# EAGLE design TinyCube01 (EAGLE 7.5.0)
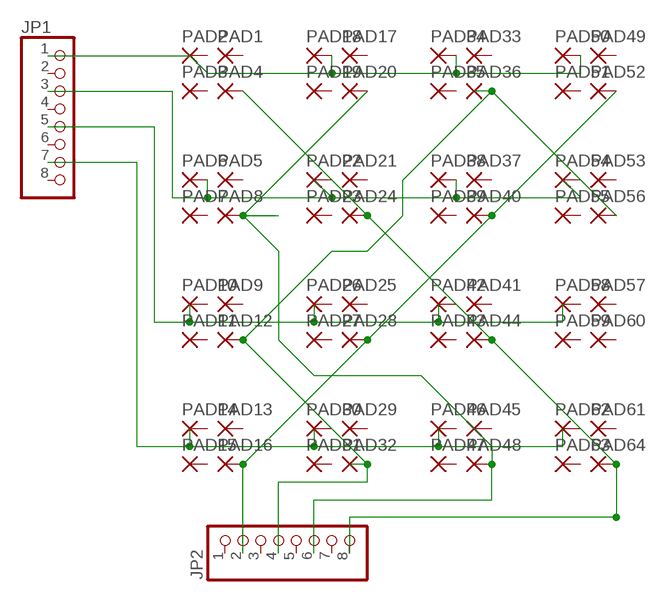
[diagram p0: schematic, sheet 1]

## Parts
JP1  PINHD-1X8BIG  [1X08-BIG]
JP2  PINHD-1X8BIG  [1X08-BIG]
PAD1  SMALLPADTHROUGH-HOLE-SMALL  [SMALLPAD]
PAD2  SMALLPADTHROUGH-HOLE-SMALL  [SMALLPAD]
PAD3  SMALLPADTHROUGH-HOLE-SMALL  [SMALLPAD]
PAD4  SMALLPADTHROUGH-HOLE-SMALL  [SMALLPAD]
PAD5  SMALLPADTHROUGH-HOLE-SMALL  [SMALLPAD]
PAD6  SMALLPADTHROUGH-HOLE-SMALL  [SMALLPAD]
PAD7  SMALLPADTHROUGH-HOLE-SMALL  [SMALLPAD]
PAD8  SMALLPADTHROUGH-HOLE-SMALL  [SMALLPAD]
PAD9  SMALLPADTHROUGH-HOLE-SMALL  [SMALLPAD]
PAD10  SMALLPADTHROUGH-HOLE-SMALL  [SMALLPAD]
PAD11  SMALLPADTHROUGH-HOLE-SMALL  [SMALLPAD]
PAD12  SMALLPADTHROUGH-HOLE-SMALL  [SMALLPAD]
PAD13  SMALLPADTHROUGH-HOLE-SMALL  [SMALLPAD]
PAD14  SMALLPADTHROUGH-HOLE-SMALL  [SMALLPAD]
PAD15  SMALLPADTHROUGH-HOLE-SMALL  [SMALLPAD]
PAD16  SMALLPADTHROUGH-HOLE-SMALL  [SMALLPAD]
PAD17  SMALLPADTHROUGH-HOLE-SMALL  [SMALLPAD]
PAD18  SMALLPADTHROUGH-HOLE-SMALL  [SMALLPAD]
PAD19  SMALLPADTHROUGH-HOLE-SMALL  [SMALLPAD]
PAD20  SMALLPADTHROUGH-HOLE-SMALL  [SMALLPAD]
PAD21  SMALLPADTHROUGH-HOLE-SMALL  [SMALLPAD]
PAD22  SMALLPADTHROUGH-HOLE-SMALL  [SMALLPAD]
PAD23  SMALLPADTHROUGH-HOLE-SMALL  [SMALLPAD]
PAD24  SMALLPADTHROUGH-HOLE-SMALL  [SMALLPAD]
PAD25  SMALLPADTHROUGH-HOLE-SMALL  [SMALLPAD]
PAD26  SMALLPADTHROUGH-HOLE-SMALL  [SMALLPAD]
PAD27  SMALLPADTHROUGH-HOLE-SMALL  [SMALLPAD]
PAD28  SMALLPADTHROUGH-HOLE-SMALL  [SMALLPAD]
PAD29  SMALLPADTHROUGH-HOLE-SMALL  [SMALLPAD]
PAD30  SMALLPADTHROUGH-HOLE-SMALL  [SMALLPAD]
PAD31  SMALLPADTHROUGH-HOLE-SMALL  [SMALLPAD]
PAD32  SMALLPADTHROUGH-HOLE-SMALL  [SMALLPAD]
PAD33  SMALLPADTHROUGH-HOLE-SMALL  [SMALLPAD]
PAD34  SMALLPADTHROUGH-HOLE-SMALL  [SMALLPAD]
PAD35  SMALLPADTHROUGH-HOLE-SMALL  [SMALLPAD]
PAD36  SMALLPADTHROUGH-HOLE-SMALL  [SMALLPAD]
PAD37  SMALLPADTHROUGH-HOLE-SMALL  [SMALLPAD]
PAD38  SMALLPADTHROUGH-HOLE-SMALL  [SMALLPAD]
PAD39  SMALLPADTHROUGH-HOLE-SMALL  [SMALLPAD]
PAD40  SMALLPADTHROUGH-HOLE-SMALL  [SMALLPAD]
PAD41  SMALLPADTHROUGH-HOLE-SMALL  [SMALLPAD]
PAD42  SMALLPADTHROUGH-HOLE-SMALL  [SMALLPAD]
PAD43  SMALLPADTHROUGH-HOLE-SMALL  [SMALLPAD]
PAD44  SMALLPADTHROUGH-HOLE-SMALL  [SMALLPAD]
PAD45  SMALLPADTHROUGH-HOLE-SMALL  [SMALLPAD]
PAD46  SMALLPADTHROUGH-HOLE-SMALL  [SMALLPAD]
PAD47  SMALLPADTHROUGH-HOLE-SMALL  [SMALLPAD]
PAD48  SMALLPADTHROUGH-HOLE-SMALL  [SMALLPAD]
PAD49  SMALLPADTHROUGH-HOLE-SMALL  [SMALLPAD]
PAD50  SMALLPADTHROUGH-HOLE-SMALL  [SMALLPAD]
PAD51  SMALLPADTHROUGH-HOLE-SMALL  [SMALLPAD]
PAD52  SMALLPADTHROUGH-HOLE-SMALL  [SMALLPAD]
PAD53  SMALLPADTHROUGH-HOLE-SMALL  [SMALLPAD]
PAD54  SMALLPADTHROUGH-HOLE-SMALL  [SMALLPAD]
PAD55  SMALLPADTHROUGH-HOLE-SMALL  [SMALLPAD]
PAD56  SMALLPADTHROUGH-HOLE-SMALL  [SMALLPAD]
PAD57  SMALLPADTHROUGH-HOLE-SMALL  [SMALLPAD]
PAD58  SMALLPADTHROUGH-HOLE-SMALL  [SMALLPAD]
PAD59  SMALLPADTHROUGH-HOLE-SMALL  [SMALLPAD]
PAD60  SMALLPADTHROUGH-HOLE-SMALL  [SMALLPAD]
PAD61  SMALLPADTHROUGH-HOLE-SMALL  [SMALLPAD]
PAD62  SMALLPADTHROUGH-HOLE-SMALL  [SMALLPAD]
PAD63  SMALLPADTHROUGH-HOLE-SMALL  [SMALLPAD]
PAD64  SMALLPADTHROUGH-HOLE-SMALL  [SMALLPAD]

## Nets
N$1: JP2.2 PAD16.1(P) PAD28.1(P) PAD40.1(P) PAD52.1(P)
N$2: JP2.8 PAD4.1(P) PAD24.1(P) PAD44.1(P) PAD64.1(P)
N$3: JP2.6 PAD8.1(P) PAD20.1(P) PAD48.1(P)
N$9: JP1.1 PAD18.1(P) PAD34.1(P) PAD50.1(P)
N$11: JP1.3 PAD6.1(P) PAD38.1(P)
N$14: JP1.5
N$15: JP1.7
W10: JP2.4 PAD12.1(P) PAD32.1(P) PAD36.1(P) PAD56.1(P)
Unconnected: JP1.2 JP1.4 JP1.6 JP1.8 JP2.1 JP2.3 JP2.5 JP2.7 PAD1.1(P) PAD2.1(P) PAD3.1(P) PAD5.1(P) PAD7.1(P) PAD9.1(P) PAD10.1(P) PAD11.1(P) PAD13.1(P) PAD14.1(P) PAD15.1(P) PAD17.1(P) PAD19.1(P) PAD21.1(P) PAD22.1(P) PAD23.1(P) PAD25.1(P) PAD26.1(P) PAD27.1(P) PAD29.1(P) PAD30.1(P) PAD31.1(P) PAD33.1(P) PAD35.1(P) PAD37.1(P) PAD39.1(P) PAD41.1(P) PAD42.1(P) PAD43.1(P) PAD45.1(P) PAD46.1(P) PAD47.1(P) PAD49.1(P) PAD51.1(P) PAD53.1(P) PAD54.1(P) PAD55.1(P) PAD57.1(P) PAD58.1(P) PAD59.1(P) PAD60.1(P) PAD61.1(P) PAD62.1(P) PAD63.1(P)

## Library data of the parts
JP1 JP2 = adafruit:PINHD-1X8: PIN HEADER
PAD1-PAD64 = smallpad:SMALLPAD: THROUGH-HOLE PAD

## Board
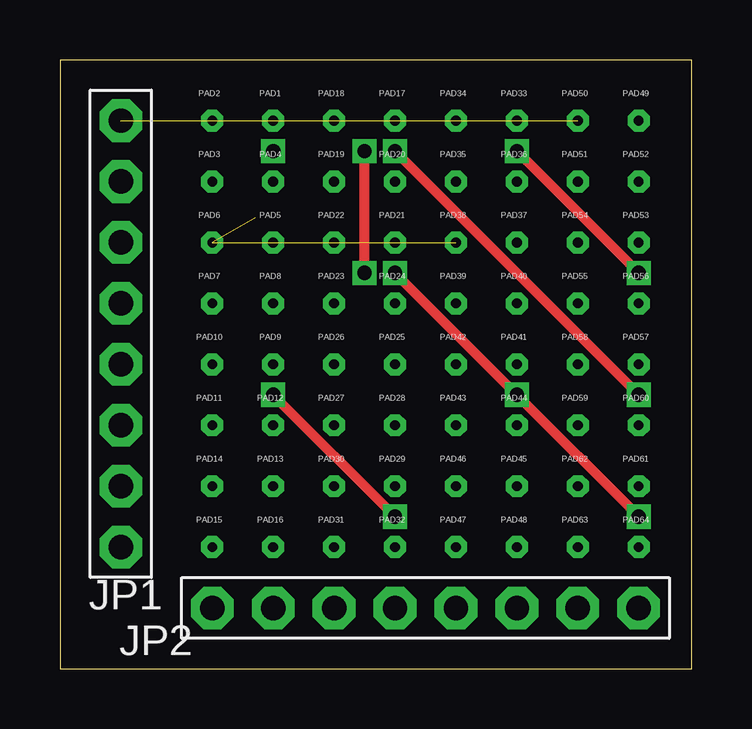
[diagram p1: board, top side]
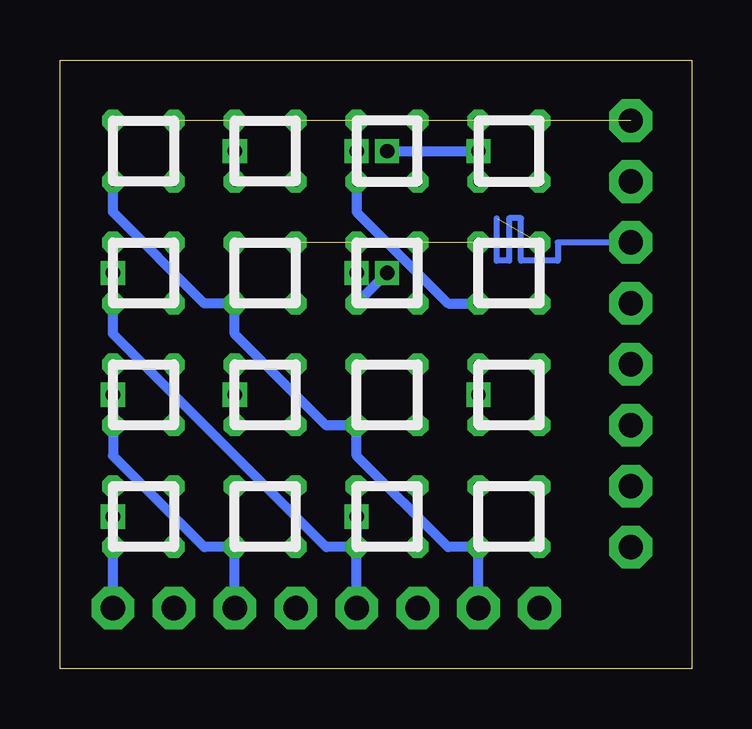
[diagram p2: board, bottom side, seen from below]

Size 26.34 x 25.39 mm. Coordinates in mm from the lower left corner, seen from the top.
Outline: 0,0 26.34,0 26.34,25.39 0,25.39 0,0
Copper layers (1*16): Top 0.035mm / dielectric 1.5mm / Bottom 0.035mm
Design rules "default": minimum track width 10mil, minimum drill 24mil, track to track 8mil, track to pad 8mil, pad to pad 8mil, via to via 8mil, smd to smd 8mil, copper to edge 40mil, drill to drill 8mil, minimum pad ring 10mil, minimum via ring 8mil, stop-mask expansion 4mil, vias tented up to drill 0mil, thermal gap 10mil

### Footprints (pad centres in the part's own frame; a part is rotated, then mirrored left to right if it is on the bottom)
1X08-BIG = drill 1.016 pad 1.778 octagon: 1 -8.89,0; 2 -6.35,0; 3 -3.81,0; 4 -1.27,0; 5 1.27,0; 6 3.81,0; 7 6.35,0; 8 8.89,0
SMALLPAD = drill 0.406 pad 0.787 octagon: 1 0,0

### Placement (x,y rotation side)
JP1  2.54,13.97 270 top
JP2  15.24,2.54 0 top
PAD1  8.89,22.86 0 top
PAD2  6.35,22.86 0 top
PAD3  6.35,20.32 0 top
PAD4  8.89,20.32 0 top
PAD5  8.89,17.78 0 top
PAD6  6.35,17.78 0 top
PAD7  6.35,15.24 0 top
PAD8  8.89,15.24 0 top
PAD9  8.89,12.7 0 top
PAD10  6.35,12.7 0 top
PAD11  6.35,10.16 0 top
PAD12  8.89,10.16 0 top
PAD13  8.89,7.62 0 top
PAD14  6.35,7.62 0 top
PAD15  6.35,5.08 0 top
PAD16  8.89,5.08 0 top
PAD17  13.97,22.86 0 top
PAD18  11.43,22.86 0 top
PAD19  11.43,20.32 0 top
PAD20  13.97,20.32 0 top
PAD21  13.97,17.78 0 top
PAD22  11.43,17.78 0 top
PAD23  11.43,15.24 0 top
PAD24  13.97,15.24 0 top
PAD25  13.97,12.7 0 top
PAD26  11.43,12.7 0 top
PAD27  11.43,10.16 0 top
PAD28  13.97,10.16 0 top
PAD29  13.97,7.62 0 top
PAD30  11.43,7.62 0 top
PAD31  11.43,5.08 0 top
PAD32  13.97,5.08 0 top
PAD33  19.05,22.86 0 top
PAD34  16.51,22.86 0 top
PAD35  16.51,20.32 0 top
PAD36  19.05,20.32 0 top
PAD37  19.05,17.78 0 top
PAD38  16.51,17.78 0 top
PAD39  16.51,15.24 0 top
PAD40  19.05,15.24 0 top
PAD41  19.05,12.7 0 top
PAD42  16.51,12.7 0 top
PAD43  16.51,10.16 0 top
PAD44  19.05,10.16 0 top
PAD45  19.05,7.62 0 top
PAD46  16.51,7.62 0 top
PAD47  16.51,5.08 0 top
PAD48  19.05,5.08 0 top
PAD49  24.13,22.86 0 top
PAD50  21.59,22.86 0 top
PAD51  21.59,20.32 0 top
PAD52  24.13,20.32 0 top
PAD53  24.13,17.78 0 top
PAD54  21.59,17.78 0 top
PAD55  21.59,15.24 0 top
PAD56  24.13,15.24 0 top
PAD57  24.13,12.7 0 top
PAD58  21.59,12.7 0 top
PAD59  21.59,10.16 0 top
PAD60  24.13,10.16 0 top
PAD61  24.13,7.62 0 top
PAD62  21.59,7.62 0 top
PAD63  21.59,5.08 0 top
PAD64  24.13,5.08 0 top

### Tracks (layer width: path | path; a pad name or v marks a point on that pad's centre or on a via)
N$1
  Bottom 0.406: JP2.2 PAD16.1 10.16,5.08 13.97,8.89 PAD28.1 15.24,10.16 19.05,13.97 PAD40.1 20.32,15.24 24.13,19.05 PAD52.1
N$2  (via drill 0.6)
  Top 0.406: v24.13,6.35 v19.05,11.43 v13.97,16.51 | v12.7,16.51 v12.7,21.59
  Bottom 0.406: JP2.8 PAD64.1 v24.13,6.35 | PAD44.1 v19.05,11.43 | PAD4.1 v8.89,21.59 v12.7,21.59 | v13.97,16.51 PAD24.1 v12.7,16.51
N$3  (via drill 0.6)
  Top 0.406: v24.13,11.43 v13.97,21.59
  Bottom 0.406: JP2.6 PAD48.1 20.32,5.08 24.13,8.89 v24.13,11.43 | v13.97,21.59 PAD20.1 13.97,19.05 10.16,15.24 PAD8.1
N$4  (via drill 0.6)
  other vias: 13.97,6.35
N$5  (via drill 0.6)
  other vias: 24.13,16.51
N$7  (via drill 0.6)
  other vias: 19.05,21.59
N$8  (via drill 0.6)
  other vias: 13.97,21.59
N$9  (3 unrouted)
N$10  (via drill 0.6)
  other vias: 24.13,6.35
N$11  (2 unrouted)
  Bottom 0.254: JP1.3 5.59,17.78 5.59,17.02 7.11,17.02 7.11,18.8 7.62,18.8 7.62,17.02 8.13,17.02 8.13,18.8
N$12  (via drill 0.6)
  other vias: 13.97,16.51
N$13  (via drill 0.6)
  other vias: 8.89,21.59
N$16  (via drill 0.6)
  other vias: 12.7,21.59
N$17  (via drill 0.6)
  other vias: 12.7,16.51
W10  (via drill 0.6)
  Top 0.406: v13.97,6.35 v8.89,11.43 | v24.13,16.51 v19.05,21.59
  Bottom 0.406: JP2.4 PAD32.1 | PAD12.1 v8.89,11.43 | v24.13,16.51 PAD56.1 24.13,13.97 15.24,5.08 PAD32.1 | v19.05,21.59 PAD36.1 | v13.97,6.35 PAD32.1